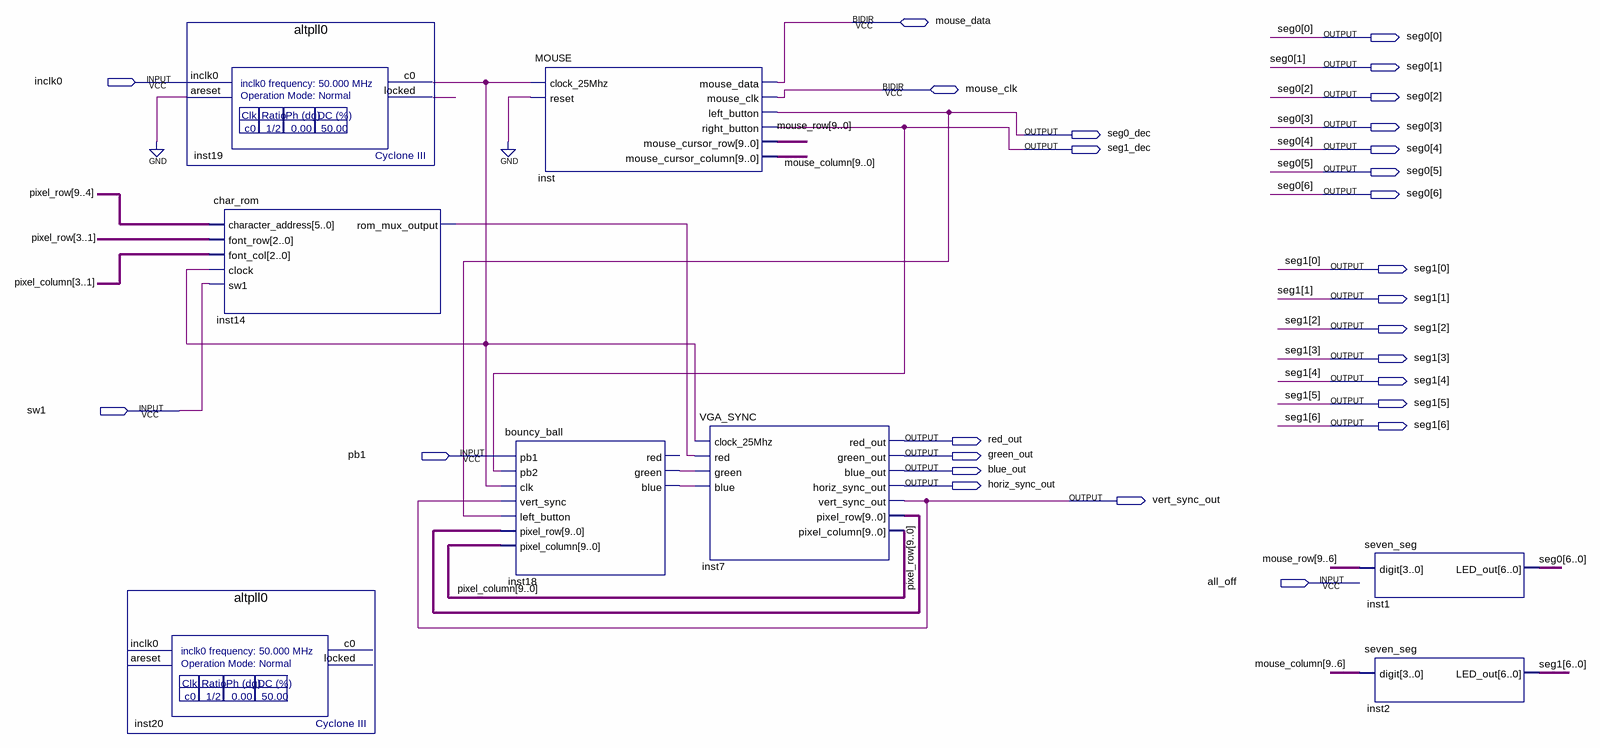
[diagram p0: schematic sheet]
// Quartus schematic MouseExample.bdf as structural Verilog: 8 symbols, 27 pins
module MouseExample (
  input  inclk0,
  input  sw1,
  input  pb1,
  input  all_off,
  inout  mouse_data,
  inout  mouse_clk,
  output [6:0] seg0,
  output seg0_dec,
  output seg1_dec,
  output [6:0] seg1,
  output red_out,
  output green_out,
  output blue_out,
  output horiz_sync_out,
  output vert_sync_out
);

  wire inst14_rom_mux_output, inst18_blue, inst18_green, inst19_c0, inst19_locked;
  wire [9:0] mouse_column, mouse_row, pixel_column, pixel_row;

  altpll0 inst20 ();  // open: inclk0, areset, c0, locked
  altpll0 inst19 (.inclk0(inclk0), .areset(1'b0), .c0(inst19_c0), .locked(inst19_locked));
  char_rom inst14 (
    .character_address(pixel_row[9:4]), .font_row(pixel_row[3:1]), .font_col(pixel_column[3:1]),
    .clock(inst19_c0), .sw1(sw1), .rom_mux_output(inst14_rom_mux_output));
  MOUSE inst (
    .clock_25Mhz(inst19_c0), .reset(1'b0), .left_button(seg0_dec), .right_button(seg1_dec),
    .mouse_cursor_row(mouse_row), .mouse_cursor_column(mouse_column), .mouse_data(mouse_data),
    .mouse_clk(mouse_clk));
  bouncy_ball inst18 (
    .pb1(pb1), .pb2(seg1_dec), .clk(inst19_c0), .vert_sync(vert_sync_out), .left_button(seg0_dec),
    .pixel_row(pixel_row), .pixel_column(pixel_column), .green(inst18_green), .blue(inst18_blue));  // open: red
  VGA_SYNC inst7 (
    .clock_25Mhz(inst19_c0), .red(inst14_rom_mux_output), .green(inst18_green), .blue(inst18_blue),
    .red_out(red_out), .green_out(green_out), .blue_out(blue_out), .horiz_sync_out(horiz_sync_out),
    .vert_sync_out(vert_sync_out), .pixel_row(pixel_row), .pixel_column(pixel_column));
  seven_seg inst1 (.digit(mouse_row[9:6]), .LED_out(seg0));
  seven_seg inst2 (.digit(mouse_column[9:6]), .LED_out(seg1));
endmodule
